# Altium schematic sheet Robot.SchDoc
size Legal
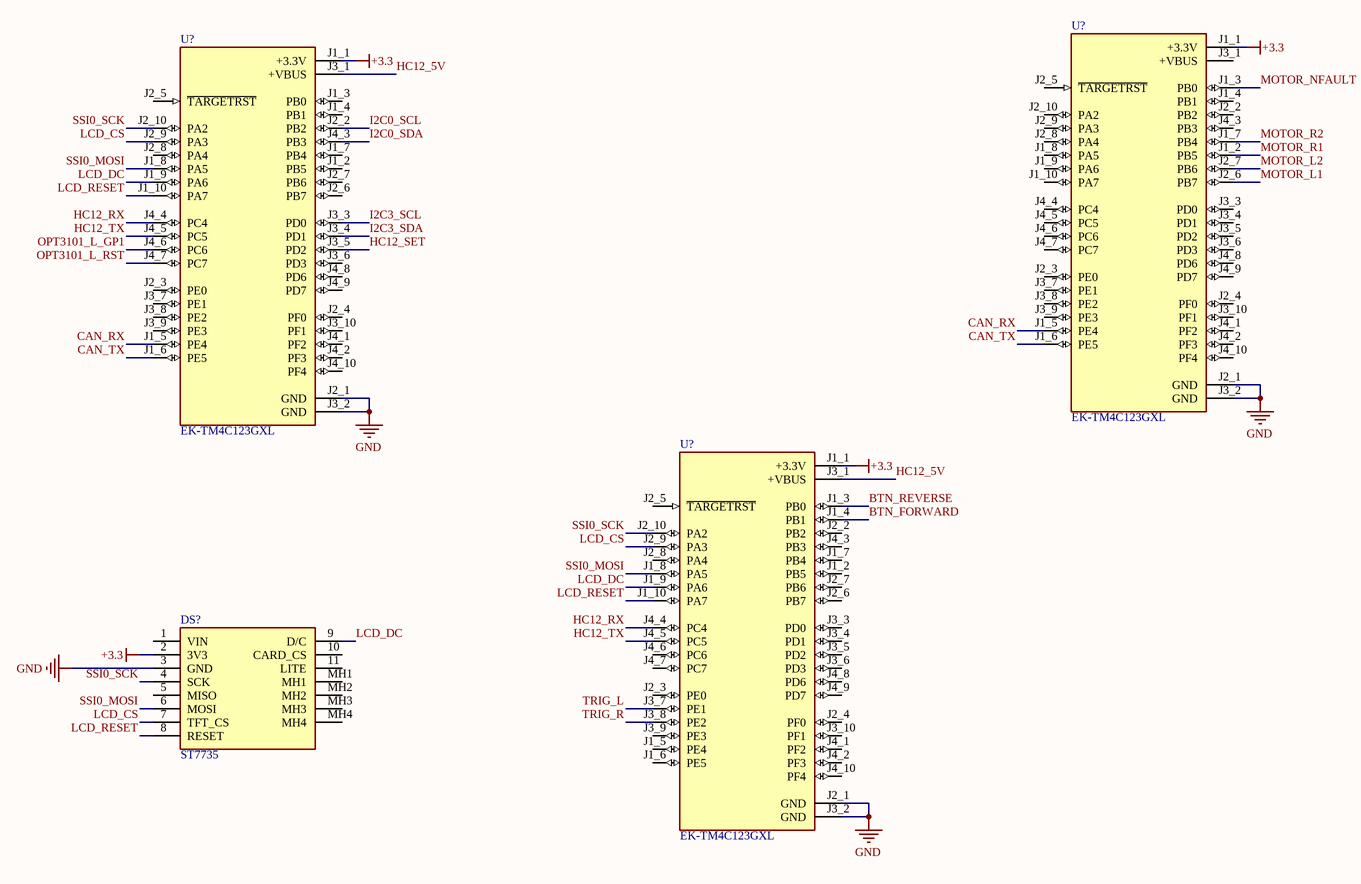
[diagram p0: Robot.SchDoc]

## Parts
(Parts that share a designator on the sheet are numbered #1, #2 ... from top to bottom, then left to right.)
DS?  ST7735  [2088]
U?#1  EK-TM4C123GXL  [MODULE_EK-TM4C123GXL]
U?#2  EK-TM4C123GXL  [MODULE_EK-TM4C123GXL]
U?#3  EK-TM4C123GXL  [MODULE_EK-TM4C123GXL]

## Nets
+3.3: DS?.2(3V3) U?#1.J1_1(+3.3V) U?#2.J1_1(+3.3V) U?#3.J1_1(+3.3V)
GND: DS?.3(GND) U?#1.J2_1(GND) U?#1.J3_2(GND) U?#2.J2_1(GND) U?#2.J3_2(GND) U?#3.J2_1(GND) U?#3.J3_2(GND)
BTN_FORWARD: U?#3.J1_4(PB1)
BTN_REVERSE: U?#3.J1_3(PB0)
CAN_RX: U?#1.J1_5(PE4) U?#2.J1_5(PE4)
CAN_TX: U?#1.J1_6(PE5) U?#2.J1_6(PE5)
HC12_5V: U?#2.J3_1(+VBUS) U?#3.J3_1(+VBUS)
HC12_RX: U?#2.J4_4(PC4) U?#3.J4_4(PC4)
HC12_SET: U?#2.J3_5(PD2)
HC12_TX: U?#2.J4_5(PC5) U?#3.J4_5(PC5)
I2C0_SCL: U?#2.J2_2(PB2)
I2C0_SDA: U?#2.J4_3(PB3)
I2C3_SCL: U?#2.J3_3(PD0)
I2C3_SDA: U?#2.J3_4(PD1)
LCD_CS: DS?.7(TFT_CS) U?#2.J2_9(PA3) U?#3.J2_9(PA3)
LCD_DC: DS?.9(D/C) U?#2.J1_9(PA6) U?#3.J1_9(PA6)
LCD_RESET: DS?.8(RESET) U?#2.J1_10(PA7) U?#3.J1_10(PA7)
MOTOR_L1: U?#1.J2_6(PB7)
MOTOR_L2: U?#1.J2_7(PB6)
MOTOR_NFAULT: U?#1.J1_3(PB0)
MOTOR_R1: U?#1.J1_2(PB5)
MOTOR_R2: U?#1.J1_7(PB4)
OPT3101_L_GP1: U?#2.J4_6(PC6)
OPT3101_L_RST: U?#2.J4_7(PC7)
SSI0_MOSI: DS?.6(MOSI) U?#2.J1_8(PA5) U?#3.J1_8(PA5)
SSI0_SCK: DS?.4(SCK) U?#2.J2_10(PA2) U?#3.J2_10(PA2)
TRIG_L: U?#3.J3_7(PE1)
TRIG_R: U?#3.J3_8(PE2)

Not connected (* = marked no-connect by the designer): DS? 1(VIN) 5(MISO) 10(CARD_CS) 11(LITE) MH1 MH2 MH3 MH4; U?#1 J1_4(PB1) J1_8(PA5) J1_9(PA6) J1_10(PA7) J2_2(PB2) J2_3(PE0) J2_4(PF0) J2_5(~{TARGETRST}) J2_8(PA4) J2_9(PA3) J2_10(PA2) J3_1(+VBUS) J3_3(PD0) J3_4(PD1) J3_5(PD2) J3_6(PD3) J3_7(PE1) J3_8(PE2) J3_9(PE3) J3_10(PF1) J4_1(PF2) J4_2(PF3) J4_3(PB3) J4_4(PC4) J4_5(PC5) J4_6(PC6) J4_7(PC7) J4_8(PD6) J4_9(PD7) J4_10(PF4); U?#2 J1_2(PB5) J1_3(PB0) J1_4(PB1) J1_7(PB4) J2_3(PE0) J2_4(PF0) J2_5(~{TARGETRST}) J2_6(PB7) J2_7(PB6) J2_8(PA4) J3_6(PD3) J3_7(PE1) J3_8(PE2) J3_9(PE3) J3_10(PF1) J4_1(PF2) J4_2(PF3) J4_8(PD6) J4_9(PD7) J4_10(PF4); U?#3 J1_2(PB5) J1_5(PE4) J1_6(PE5) J1_7(PB4) J2_2(PB2) J2_3(PE0) J2_4(PF0) J2_5(~{TARGETRST}) J2_6(PB7) J2_7(PB6) J2_8(PA4) J3_3(PD0) J3_4(PD1) J3_5(PD2) J3_6(PD3) J3_9(PE3) J3_10(PF1) J4_1(PF2) J4_2(PF3) J4_3(PB3) J4_6(PC6) J4_7(PC7) J4_8(PD6) J4_9(PD7) J4_10(PF4)

## Library data of the parts
DS? = 2088: Display; Manufacturer_Name: Adafruit; Datasheet Link: https://learn.adafruit.com/downloads/pdf/adafruit-1-44-color-tft-with-micro-sd-socket.pdf; Height: 7mm; Manufacturer_Part_Number: 2088; Mouser Part Number: 485-2088; Mouser Price/Stock: https://www.mouser.co.uk/ProductDetail/Adafruit/2088/?qs=GURawfaeGuDQCatXEXSNAg%3D%3D; Arrow Part Number: 2088; Arrow Price/Stock: https://www.arrow.com/en/products/2088/adafruit-industries
U?#1-U?#3 = EK-TM4C123GXL: ARMÂ® CortexÂ®-M4F Based MCU TM4C123G LaunchPadâ„¢ Evaluation Kit; MF: {'manufacturer': u'Texas Instruments'}; Availability: Unavailable; Value: *; Price: None; Package: None; MP: EK-TM4C123GXL